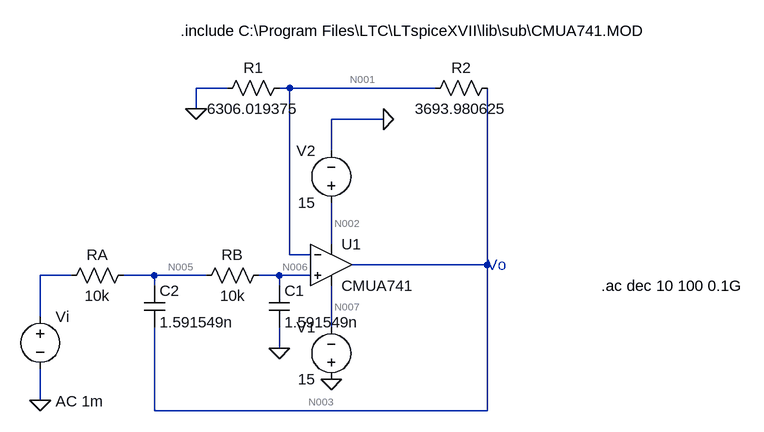
[diagram p0: schematic part A op amp first.asc]
part A op amp first.asc, the LTspice schematic file:
Version 4
SHEET 1 1484 680
WIRE 144 -128 96 -128
WIRE 240 -128 224 -128
WIRE 464 -128 240 -128
WIRE 96 -96 96 -128
WIRE 384 -80 304 -80
WIRE 304 -32 304 -80
WIRE 304 112 304 48
WIRE 240 128 240 -128
WIRE 272 128 240 128
WIRE 544 144 544 -128
WIRE 544 144 336 144
WIRE -96 160 -144 160
WIRE 32 160 -16 160
WIRE 112 160 32 160
WIRE 224 160 192 160
WIRE 272 160 224 160
WIRE 32 176 32 160
WIRE 224 176 224 160
WIRE -144 224 -144 160
WIRE 304 240 304 176
WIRE 224 272 224 240
WIRE -144 352 -144 304
WIRE 32 368 32 240
WIRE 544 368 544 144
WIRE 544 368 32 368
FLAG 304 320 0
FLAG 384 -80 0
FLAG 224 272 0
FLAG 96 -96 0
FLAG -144 352 0
SYMBOL voltage 304 336 R180
WINDOW 0 24 96 Left 2
WINDOW 3 24 16 Left 2
WINDOW 123 0 0 Left 0
WINDOW 39 0 0 Left 0
SYMATTR InstName V1
SYMATTR Value 15
SYMBOL voltage 304 64 R180
WINDOW 0 24 96 Left 2
WINDOW 3 24 16 Left 2
WINDOW 123 0 0 Left 0
WINDOW 39 0 0 Left 0
SYMATTR InstName V2
SYMATTR Value 15
SYMBOL res 560 -144 R90
WINDOW 0 0 56 VBottom 2
WINDOW 3 32 56 VTop 2
SYMATTR InstName R2
SYMATTR Value 3693.980625
SYMBOL res 240 -144 R90
WINDOW 0 0 56 VBottom 2
WINDOW 3 32 56 VTop 2
SYMATTR InstName R1
SYMATTR Value 6306.019375
SYMBOL res 208 144 R90
WINDOW 0 0 56 VBottom 2
WINDOW 3 32 56 VTop 2
SYMATTR InstName RB
SYMATTR Value 10k
SYMBOL res 0 144 R90
WINDOW 0 0 56 VBottom 2
WINDOW 3 32 56 VTop 2
SYMATTR InstName RA
SYMATTR Value 10k
SYMBOL cap 208 176 R0
SYMATTR InstName C1
SYMATTR Value 1.591549n
SYMBOL cap 16 176 R0
SYMATTR InstName C2
SYMATTR Value 1.591549n
SYMBOL voltage -144 208 R0
WINDOW 123 24 146 Left 2
WINDOW 39 0 0 Left 0
SYMATTR InstName Vi
SYMATTR Value ""
SYMATTR Value2 AC 1m
SYMBOL OpAmps\\opamp2 304 80 R0
SYMATTR InstName U1
SYMATTR Value CMUA741
TEXT 72 -216 Left 2 !.include C:\\Program Files\\LTC\\LTspiceXVII\\lib\\sub\\CMUA741.MOD
TEXT 544 144 Left 2 ;Vo
TEXT 720 176 Left 2 !.ac dec 10 100 0.1G

The netlist it stands for:
* part A op amp first.asc
V1 0 N007 15
V2 N002 0 15
R2 N003 N001 3693.980625
R1 N001 0 6306.019375
RB N006 N005 10k
RA N005 N004 10k
C1 N006 0 1.591549n
C2 N005 N003 1.591549n
Vi N004 0 AC 1m
XU1 N006 N001 N002 N007 N003 CMUA741  ; pins In+ In- V+ V- OUT
.include C:\Program Files\LTC\LTspiceXVII\lib\sub\CMUA741.MOD
* Vo
.ac dec 10 100 0.1G
.backanno
.end

* Results of the author's LTspice run, read from the files saved beside the schematic
* Operating Point, zero values left out:
*   V(n007) = -15 V
*   V(n002) = 15 V
*   V(n003) = -2.216 mV
*   V(n001) = -1.583 mV
*   V(n006) = -1.595 mV
*   V(n005) = -797.3 µV
*   I(Ra) = -79.73 nA
*   I(Rb) = -79.73 nA
*   I(R1) = -251.1 nA
*   I(R2) = -171.3 nA
*   I(Vi) = -79.73 nA
*   I(V2) = -1.667 mA
*   I(V1) = -1.667 mA
*   Ix(u1:1) = 79.73 nA
*   Ix(u1:2) = 79.76 nA
*   Ix(u1:3) = 1.667 mA
*   Ix(u1:4) = -1.667 mA
*   Ix(u1:5) = 171.3 nA
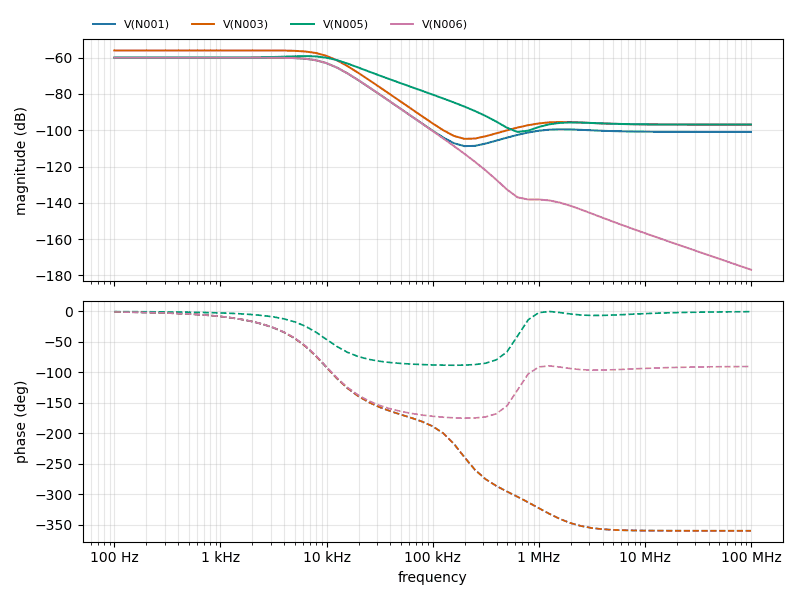
[diagram p1: AC Analysis of part A op amp first.asc, plotted from the saved traces]
* AC Analysis, 1 run:
*   V(N001): -60.00 dB at 100 Hz, -100.88 dB at 100 MHz, peak -60.00 dB at 1.585 kHz, 3 dB below the peak at 9.992 kHz
*   V(N003): -56.00 dB at 100 Hz, -96.86 dB at 100 MHz, peak -55.99 dB at 1.585 kHz, 3 dB below the peak at 9.992 kHz
*   V(N005): -60.00 dB at 100 Hz, -96.86 dB at 100 MHz, peak -59.14 dB at 6.31 kHz, 3 dB below the peak at 13.81 kHz
*   V(N006): -60.00 dB at 100 Hz, -176.80 dB at 100 MHz, peak -60.00 dB at 1.585 kHz, 3 dB below the peak at 9.991 kHz